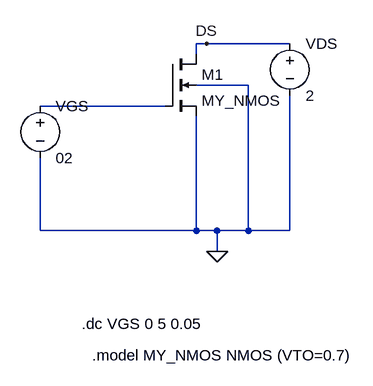
[diagram p0: schematic nmos_iv_transfer.asc]
nmos_iv_transfer.asc, the LTspice schematic file:
Version 4.1
SHEET 1 880 680
WIRE 176 -112 160 -112
WIRE 304 -112 176 -112
WIRE 160 -96 160 -112
WIRE 240 -48 160 -48
WIRE 112 -16 -80 -16
WIRE -80 176 -80 64
WIRE 160 176 160 0
WIRE 160 176 -80 176
WIRE 192 176 160 176
WIRE 240 176 240 -48
WIRE 240 176 192 176
WIRE 304 176 304 -32
WIRE 304 176 240 176
WIRE 192 208 192 176
FLAG 176 -112 DS
FLAG 192 208 0
SYMBOL voltage -80 -32 R0
WINDOW 123 0 0 Left 0
WINDOW 39 0 0 Left 0
SYMATTR InstName VGS
SYMATTR Value 02
SYMBOL voltage 304 -128 R0
WINDOW 123 0 0 Left 0
WINDOW 39 0 0 Left 0
SYMATTR InstName VDS
SYMATTR Value 2
SYMBOL nmos4 112 -96 R0
SYMATTR InstName M1
SYMATTR Value MY_NMOS
TEXT -16 320 Left 2 !.dc VGS 0 5 0.05
TEXT 0 368 Left 2 !.model MY_NMOS NMOS (VTO=0.7)

The netlist it stands for:
* nmos_iv_transfer.asc
VGS N001 0 02
VDS DS 0 2
M1 DS N001 0 0 MY_NMOS
.model NMOS NMOS
.model PMOS PMOS
.lib standard.mos
.dc VGS 0 5 0.05
.model MY_NMOS NMOS (VTO=0.7)
.backanno
.end